# Altium schematic sheet STM32 Core board.SchDoc
size OrCAD C; SheetNumber: 1; SheetTotal: 1
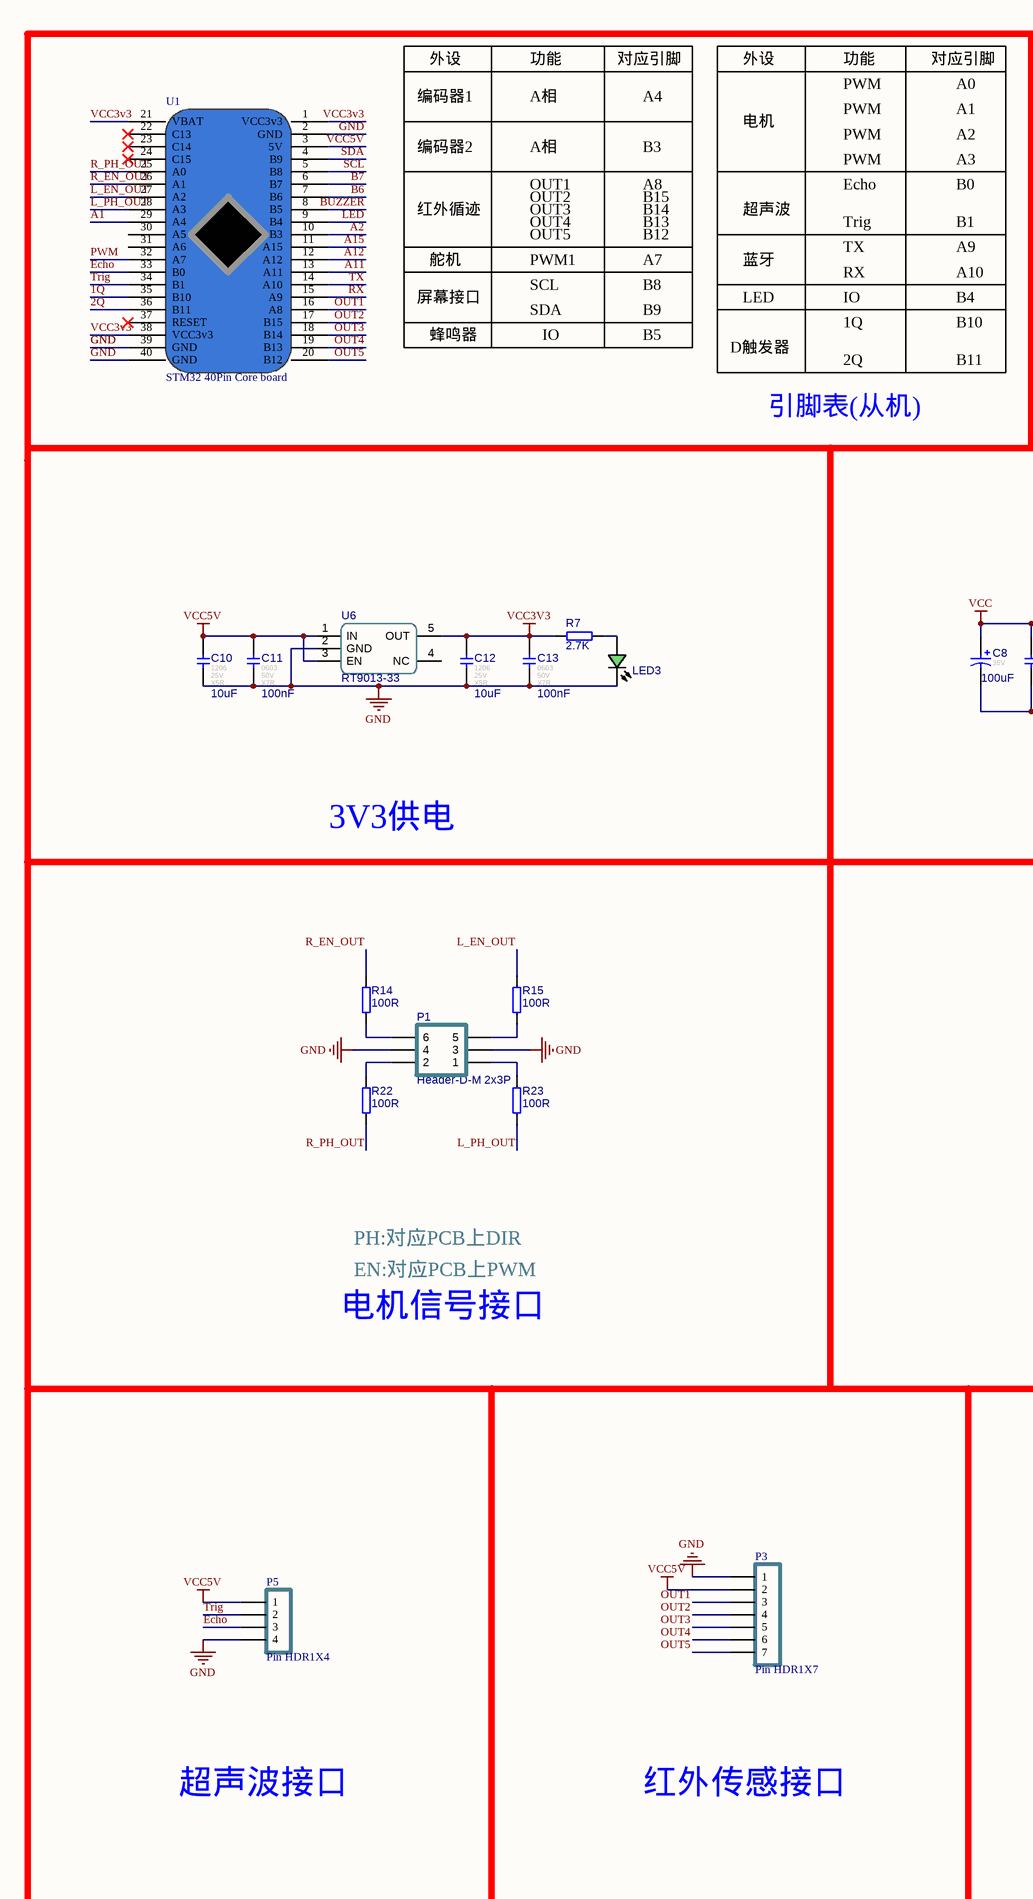
[diagram p0: STM32 Core board.SchDoc, left]
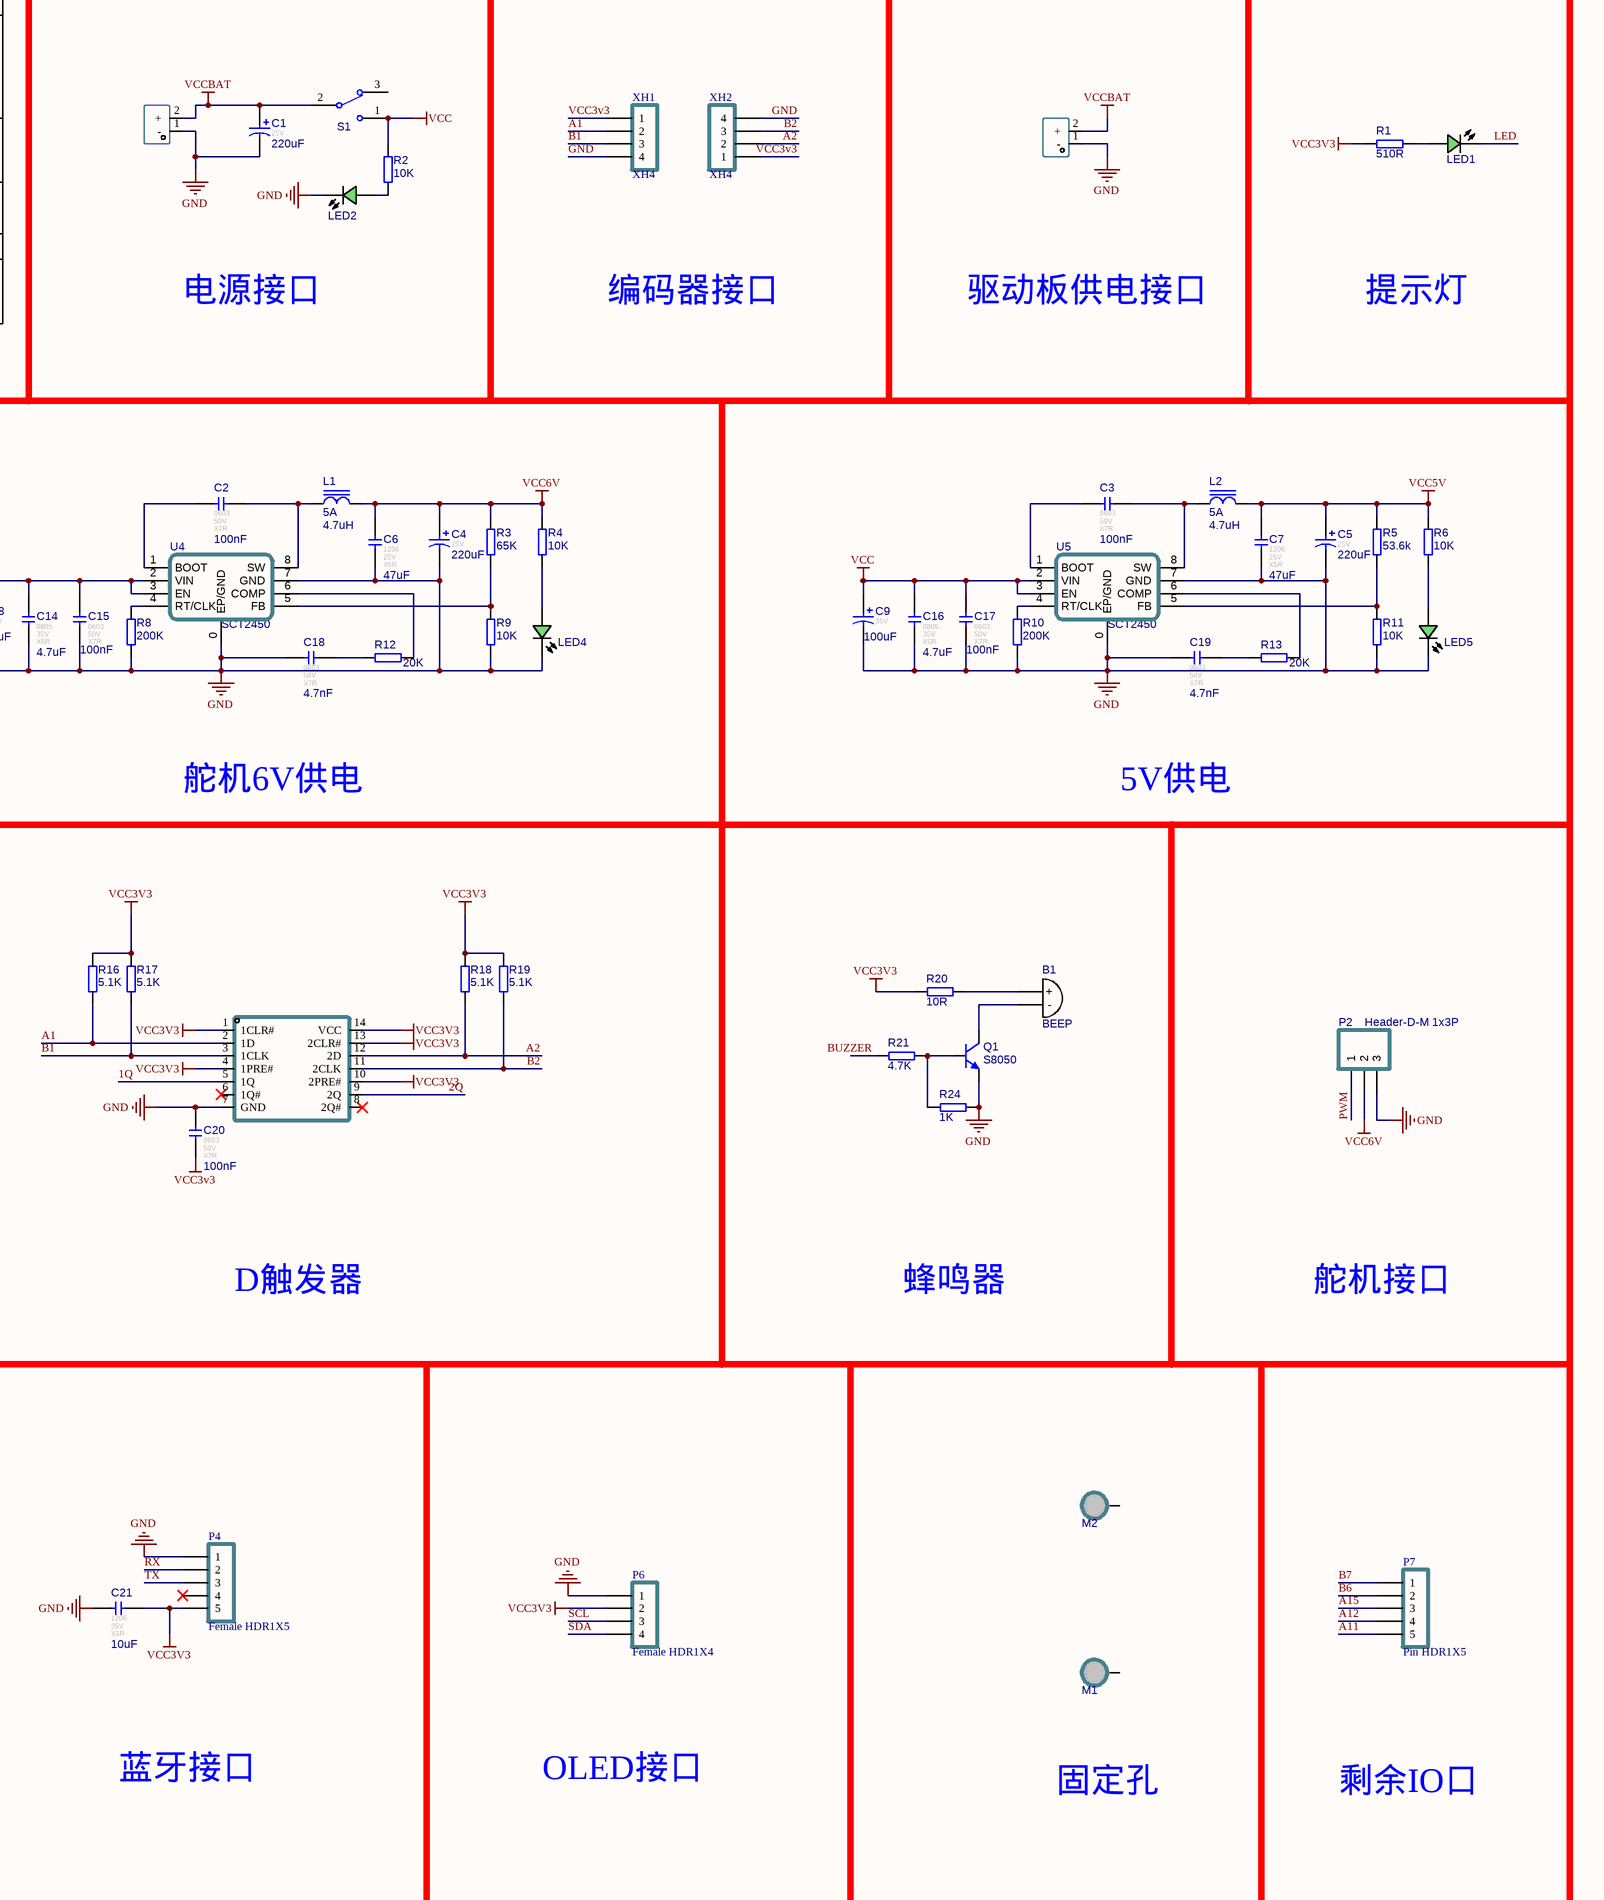
[diagram p1: STM32 Core board.SchDoc, right]

## Parts
B1  BEEP  [BEEP 9x5.5mm]
C1  value 220uF  Voltage: 25V  [CAP-E-S 6.3]  (hidden comment: 220uF 25V 铝电解)
C2  value 100nF  FootPrint: 0603  Voltage: 50V  Type: X7R  [C0805]  (hidden comment: 100nF 50V X7R)
C3  value 100nF  FootPrint: 0603  Voltage: 50V  Type: X7R  [C0805]  (hidden comment: 100nF 50V X7R)
C4  value 220uF  Voltage: 25V  [CAP-E-S 6.3]  (hidden comment: 220uF 25V 铝电解)
C5  value 220uF  Voltage: 25V  [CAP-E-S 6.3]  (hidden comment: 220uF 25V 铝电解)
C6  value 47uF  FootPrint: 1206  Voltage: 25V  Type: X5R  [C0805]  (hidden comment: 47uF 25V X5R)
C7  value 47uF  FootPrint: 1206  Voltage: 25V  Type: X5R  [C0805]  (hidden comment: 47uF 25V X5R)
C8  value 100uF  Voltage: 35V  [CAP-E-S 6.3]  (hidden comment: 100uF 35V 铝电解)
C9  value 100uF  Voltage: 35V  [CAP-E-S 6.3]  (hidden comment: 100uF 35V 铝电解)
C10  value 10uF  FootPrint: 1206  Voltage: 25V  Type: X5R  [C0805]  (hidden comment: 10uF 25V X5R)
C11  value 100nF  FootPrint: 0603  Voltage: 50V  Type: X7R  [C0805]  (hidden comment: 100nF 50V X7R)
C12  value 10uF  FootPrint: 1206  Voltage: 25V  Type: X5R  [C0805]  (hidden comment: 10uF 25V X5R)
C13  value 100nF  FootPrint: 0603  Voltage: 50V  Type: X7R  [C0805]  (hidden comment: 100nF 50V X7R)
C14  value 4.7uF  FootPrint: 0805  Voltage: 35V  Type: X5R  [C0805]  (hidden comment: 4.7uF 35V X5R)
C15  value 100nF  FootPrint: 0603  Voltage: 50V  Type: X7R  [C0805]  (hidden comment: 100nF 50V X7R)
C16  value 4.7uF  FootPrint: 0805  Voltage: 35V  Type: X5R  [C0805]  (hidden comment: 4.7uF 35V X5R)
C17  value 100nF  FootPrint: 0603  Voltage: 50V  Type: X7R  [C0805]  (hidden comment: 100nF 50V X7R)
C18  value 4.7nF  FootPrint: 0603  Voltage: 50V  Type: X7R  [C0805]  (hidden comment: 4.7nF 50V X7R)
C19  value 4.7nF  FootPrint: 0603  Voltage: 50V  Type: X7R  [C0805]  (hidden comment: 4.7nF 50V X7R)
C20  value 100nF  FootPrint: 0603  Voltage: 50V  Type: X7R  [C0805]  (hidden comment: 100nF 50V X7R)
C21  value 10uF  FootPrint: 1206  Voltage: 35V  Type: X5R  [CAPC3216[1206]S]  (hidden comment: 10uF 35V X5R)
L1  value 4.7uH  Imax: 5A  [0630 TPC 7*7*3]  (hidden comment: 4.7uH 5A)
L2  value 4.7uH  Imax: 5A  [0630 TPC 7*7*3]  (hidden comment: 4.7uH 5A)
LED1  翠绿贴片LED  [LED_0805]  (value not drawn)
LED2  翠绿贴片LED  [LED_0805]  (value not drawn)
LED3  翠绿贴片LED  [LED_0805]  (value not drawn)
LED4  翠绿贴片LED  [LED_0805]  (value not drawn)
LED5  翠绿贴片LED  [LED_0805]  (value not drawn)
M1  MountHole  [M3-MountHole]  (value not drawn)  (no BOM)
M2  MountHole  [M3-MountHole]  (value not drawn)  (no BOM)
P1  Header-D-M 2x3P  [HDR2X3-M]
P2  Header-D-M 1x3P  [HDR1X3-M]
P3  Pin HDR1X7  [Pin HDR1X7/2.54mm-S]
P4  Female HDR1X5  [Fe-HDR1X5/2.54-S]
P5  Pin HDR1X4  [Pin HDR1X4/2.54mm-S]
P6  Female HDR1X4  [Fe-HDR1X4/2.54-S]
P7  Pin HDR1X5  [Pin HDR1X5/2.54mm-S]
Q1  S8050  [SOT-23]
R1  value 510R  [R0805 - duplicate]  (hidden comment: 510R ±1%)
R2  value 10K  [R0805 - duplicate]  (hidden comment: 10K ±1%)
R3  value 65K  [R0805 - duplicate]  (hidden comment: 65K ±1%)
R4  value 10K  [R0805 - duplicate]  (hidden comment: 10K ±1%)
R5  value 53.6k  [R0805 - duplicate]  (hidden comment: 53.6k ±1%)
R6  value 10K  [R0805 - duplicate]  (hidden comment: 10K ±1%)
R7  value 2.7K  [R0805 - duplicate]  (hidden comment: 2.7K ±1%)
R8  value 200K  [R0805 - duplicate]  (hidden comment: 200K ±1%)
R9  value 10K  [R0805 - duplicate]  (hidden comment: 10K ±1%)
R10  value 200K  [R0805 - duplicate]  (hidden comment: 200K ±1%)
R11  value 10K  [R0805 - duplicate]  (hidden comment: 10K ±1%)
R12  value 20K  [R0805 - duplicate]  (hidden comment: 20K ±1%)
R13  value 20K  [R0805 - duplicate]  (hidden comment: 20K ±1%)
R14  value 100R  [R0805 - duplicate]  (hidden comment: 100R ±1%)
R15  value 100R  [R0805 - duplicate]  (hidden comment: 100R ±1%)
R16  value 5.1K  [R0805 - duplicate]  (hidden comment: 5.1K ±1%)
R17  value 5.1K  [R0805 - duplicate]  (hidden comment: 5.1K ±1%)
R18  value 5.1K  [R0805 - duplicate]  (hidden comment: 5.1K ±1%)
R19  value 5.1K  [R0805 - duplicate]  (hidden comment: 5.1K ±1%)
R20  value 10R  [R0805 - duplicate]  (hidden comment: 10R ±1%)
R21  value 4.7K  [R0805 - duplicate]  (hidden comment: 4.7K ±1%)
R22  value 100R  [R0805 - duplicate]  (hidden comment: 100R ±1%)
R23  value 100R  [R0805 - duplicate]  (hidden comment: 100R ±1%)
R24  value 1K  [R0805 - duplicate]  (hidden comment: 1K ±1%)
S1  SW-SPDT  [SS12D10]  (value not drawn)
U1  STM32 40Pin Core board  [STM32 Core board]
U2  XT60  [CONN-TH_XT60]  (value not drawn)
U3  XT60  [CONN-TH_XT60]  (value not drawn)
U4  SCT2450  [SOP-8E]
U5  SCT2450  [SOP-8E]
U6  RT9013-33  [SOT-23-5]
U7  SN74HC74D  [SOIC-14_L8.7-W3.9-P1.27-LS6.0-BL]  (value not drawn)
XH1  XH4  [XH4/2.54mm/180 - duplicate]
XH2  XH4  [XH4/2.54mm/180 - duplicate]

## Nets
GND: C1.2 C4.2 C5.2 C6.1 C7.1 C8.2 C9.2 C10.1 C11.1 C12.1 C13.1 C14.1 C15.1 C16.1 C17.1 C18.1 C19.1 C20.2 C21.1 LED2.C LED3.C LED4.C LED5.C P1.3 P1.4 P2.3 P3.1 P4.1 P5.4 P6.1 Q1.2(E) R8.1 R9.2 R10.1 R11.2 R24.2 U1.2(GND) U1.39(GND) U1.40(GND) U2.1(-) U3.1(-) U4.0(EP/GND) U4.7(GND) U5.0(EP/GND) U5.7(GND) U6.2(GND) U7.7(GND) XH1.4 XH2.4
VCC: C8.1 C9.1 C14.2 C15.2 C16.2 C17.2 R2.2 S1.1 U4.2(VIN) U4.3(EN) U5.2(VIN) U5.3(EN)
VCC3v3: C12.2 C13.2 C20.1 C21.2 P4.5 P6.2 R1.1 R7.1 R16.2 R17.2 R18.2 R19.2 R20.1 U1.1(VCC3v3) U1.21(VBAT) U1.38(VCC3v3) U6.5(OUT) U7.1(1CLR#) U7.4(1PRE#) U7.10(2PRE#) U7.13(2CLR#) U7.14(VCC) XH1.1 XH2.1
VCC5V: C5.1 C7.2 C10.2 C11.2 L2.2 P3.2 P5.1 R5.2 R6.1 U1.3(5V) U6.1(IN) U6.3(EN)
VCC6V: C4.1 C6.2 L1.2 P2.2 R3.2 R4.1
VCCBAT: C1.1 S1.2 U2.2(+) U3.2(+)
1Q: U1.35(B10) U7.5(1Q)
2Q: U1.36(B11) U7.9(2Q)
A1: R16.1 U1.29(A4) U7.2(1D) XH1.2
A2: R18.1 U1.10(B3) U7.12(2D) XH2.2
A11: P7.5 U1.13(A11)
A12: P7.4 U1.12(A12)
A15: P7.3 U1.11(A15)
B1: R17.1 U7.3(1CLK) XH1.3
B2: R19.1 U7.11(2CLK) XH2.3
B6: P7.2 U1.7(B6)
B7: P7.1 U1.6(B7)
BUZZER: R21.1 U1.8(B5)
Echo: P5.3 U1.33(B0)
L_EN_OUT: R15.1 U1.27(A2)
L_PH_OUT: R23.2 U1.28(A3)
LED: LED1.C U1.9(B4)
OUT1: P3.3 U1.16(A8)
OUT2: P3.4 U1.17(B15)
OUT3: P3.5 U1.18(B14)
OUT4: P3.6 U1.19(B13)
OUT5: P3.7 U1.20(B12)
PWM: P2.1 U1.32(A7)
R_EN_OUT: R14.1 U1.26(A1)
R_PH_OUT: R22.2 U1.25(A0)
RX: P4.2 U1.15(A9)
SCL: P6.3 U1.5(B8)
SDA: P6.4 U1.4(B9)
Trig: P5.2 U1.34(B1)
TX: P4.3 U1.14(A10)
NetB1_1: B1.1(+) R20.2
NetB1_2: B1.2(-) Q1.3(C)
NetC2_1: C2.1 L1.1 U4.8(SW)
NetC2_2: C2.2 U4.1(BOOT)
NetC3_1: C3.1 L2.1 U5.8(SW)
NetC3_2: C3.2 U5.1(BOOT)
NetC18_2: C18.2 R12.1
NetC19_2: C19.2 R13.1
NetLED1_A: LED1.A R1.2
NetLED2_A: LED2.A R2.1
NetLED3_A: LED3.A R7.2
NetLED4_A: LED4.A R4.2
NetLED5_A: LED5.A R6.2
NetP1_1: P1.1 R23.1
NetP1_2: P1.2 R22.1
NetP1_5: P1.5 R15.2
NetP1_6: P1.6 R14.2
NetQ1_1: Q1.1(B) R21.2 R24.1
NetR3_1: R3.1 R9.1 U4.5(FB)
NetR5_1: R5.1 R11.1 U5.5(FB)
NetR8_2: R8.2 U4.4(RT/CLK)
NetR10_2: R10.2 U5.4(RT/CLK)
NetR12_2: R12.2 U4.6(COMP)
NetR13_2: R13.2 U5.6(COMP)

Not connected (* = marked no-connect by the designer): M1 1; M2 1; P4 4*; S1 3; U1 22(C13)* 23(C14)* 24(C15)* 30(A5) 31(A6) 37(RESET)*; U6 4(NC); U7 6(1Q#)* 8(2Q#)*

## Notes on the sheet
- 编码器1
- 外设
- 功能
- A相
- 对应引脚
- A4
- PWM
- A0
- 编码器2
- B3
- 电机
- A1
- A2
- A3
- 红外循迹
- OUT1
- OUT2
- OUT3
- OUT4
- B13
- B14
- B15
- A8
- 超声波
- Echo
- Trig
- B0
- B1
- 舵机
- PWM1
- OUT5
- SCL
- B12
- A7
- B8
- 蓝牙
- RX
- TX
- A10
- A9
- 屏幕接口
- 蜂鸣器
- SDA
- IO
- B5
- B9
- D触发器
- LED
- 1Q
- B4
- B10
- 2Q
- B11
- 电源接口
- 编码器接口
- 驱动板供电接口
- 提示灯
- 引脚表(从机)
- 3V3供电
- 舵机6V供电
- 5V供电
- PH:对应PCB上DIR
- EN:对应PCB上PWM
- 电机信号接口
- 舵机接口
- 超声波接口
- 红外传感接口
- 蓝牙接口
- OLED接口
- 固定孔
- 剩余IO口

## Library data of the parts
B1 = BEEP: 蜂鸣器
C1 C4 C5 = E-S 220uF 25V 6.3x7.7: 贴片电解电容 220uF 25V 6.3x7.7; Revision: V1.0; Type: 铝电解
C2 C3 C11 C13 C15 C17 C20 = 100nF 0603 50V X7R: 贴片瓷片电容; MLCC; 0603(1608);; Revision: V1.0
C6 C7 C10 C12 = 47uF 1206 25V X5R: 贴片瓷片电容; MLCC; 1206(3216);; Revision: V1.0
C8 C9 = E-S 100uF 35V 6.3x7.7: 贴片电解电容 100uF 35V 6.3x7.7; Revision: V1.0; Type: 铝电解
C14 C16 C21 = 4.7uF 1206 35V X5R: 贴片瓷片电容; MLCC; 1206(3216);; Revision: V1.0
C18 C19 = 4.7nF 0603 50V X7R: 贴片瓷片电容; MLCC; 0603(1608);; Revision: V1.0
L1 L2 = Ind-Power: 功率电感; DCR: .5m; Published: 8-Jun-2000; Revision: July-2002: Re-released for DXP Platform.; Publisher: Altium Limited; Price(RMB): 0.000
LED1-LED5 = LED Chip Green: Published: 8-Jun-2000; Revision: July-2002: Re-released for DXP Platform.; Publisher: Altium Limited; Price(RMB): 0.00
M1 M2 = MountHole: 固定孔
P1 = Header-D-M 2x3P: 2x3pin, 直插, 双排针; Revision: V1.0; Value: Header-D-M 2x3P
P2 = Header-D-M 1x3P: 1x3pin, 直插, 排针; Revision: V1.0; Value: Header-D-M 1x3P
Q1 = NPN S8050: NPN 三极管; Published: 8-Jun-2000; Revision: July-2002: Re-released for DXP Platform.; Publisher: Altium Limited; Price(RMB): 0.000; PartNumber: S8050
R1 R14 R15 R22 R23 = Res-Chip_9: 贴片电阻; Power: 1/8W; Revision: V1.0; Tolerance: ±1%
R2 R4 R6 R9 R11 = Res-Chip: 贴片电阻; Power: 1/8W; Revision: V1.0; Tolerance: ±1%
R3 R5 R12 R13 = Res-Chip_4: 贴片电阻; Power: 1/8W; Revision: V1.0; Tolerance: ±1%
R7 = Res-Chip_6: 贴片电阻; Power: 1/8W; Revision: V1.0; Tolerance: ±1%
R8 R10 = Res-Chip_1: 贴片电阻; Power: 1/8W; Revision: V1.0; Tolerance: ±1%
R16-R19 R21 = Res-Chip_3: 贴片电阻; Power: 1/8W; Revision: V1.0; Tolerance: ±1%
R20 = Res-Chip_10: 贴片电阻; Power: 1/8W; Revision: V1.0; Tolerance: ±1%
R24 = Res-Chip_11: 贴片电阻; Power: 1/8W; Revision: V1.0; Tolerance: ±1%
S1 = SW-SPDT: 单刀双掷开关 3脚船型、钮子、拨动开关 SPDT Subminiature Toggle Switch; Published: 24-Mar-1999; Publisher: Altium Limited; Price(RMB): 0.000
U1 = STM32 Core board: 江协科技STM32F103C8T6核心板
U2 U3 = XT60: Manufacturer: AMASS(艾迈斯); Add into BOM: yes; Brand: 艾迈斯; InterfaceType: 公头; specifications: 3.5mm; Name: XT60; Symbol: XT60; Device: XT60; LCSC Part Name: AMASS(艾迈斯) XT60模型插头 3.5mm镀金香蕉头公头（电调端）XT60-M; Supplier Part: C98733; Manufacturer Part: XT60; Supplier Footprint: -; JLCPCB Part Class: Extended Part; Datasheet: https://atta.szlcsc.com/upload/public/pdf/source/20170606/1496716524919.pdf; Supplier: LCSC; Convert to PCB: yes; Model: XT60; Power: -; Output: -; Input: -; Size: -; Interface: -; Type: 香蕉头; Colour: 黄色; MaximumCurrent: -; RatedVoltage: -; Type1: -; NumberOfUSBHoles: -; MetalMaterial: -; InsulationMaterial: -; RatedCurrent: -; RecommendedWireGauge: -; FlameRetardantGrade: -; contact resistance: -; Belt length: -
U4 U5 = SP1N28STER: Revision: V1.0; Value: SCT2450
U6 = RT9013-33: 3.3V 500mA SOT-23-5 LDO
U7 = SN74HC74D: Manufacturer: TI(德州仪器); Add into BOM: yes; Trigger Type: 上升沿; Supply Voltage: 2V~6V; Clock Frequency: 60MHz; Function: 置位和复位; Number of Elements: 2; Number of Bits per Element: 1; Output Type: 互补型; Maximum Propagation Delay: 15ns@6V,50pF; Sink Current: 5.2mA; Quiescent Current (Iq): 4uA; Input Capacitance: 3pF; Name: SN74HC74D; Symbol: SN74HC74D; Device: SN74HC74D; LCSC Part Name: SN74HC74D; Supplier Part: C347585; Manufacturer Part: SN74HC74D; Supplier Footprint: SOIC-14; JLCPCB Part Class: Extended Part; Datasheet: https://www.ti.com/cn/lit/gpn/sn74hc74; Supplier: LCSC; Convert to PCB: yes; Type: D-型; Series: 74HC系列; Source Current: 5.2mA; Operating Temperature: -40℃~+85℃